# Altium schematic sheet 09. SDIO, PERIPHERAL.SchDoc
size A3
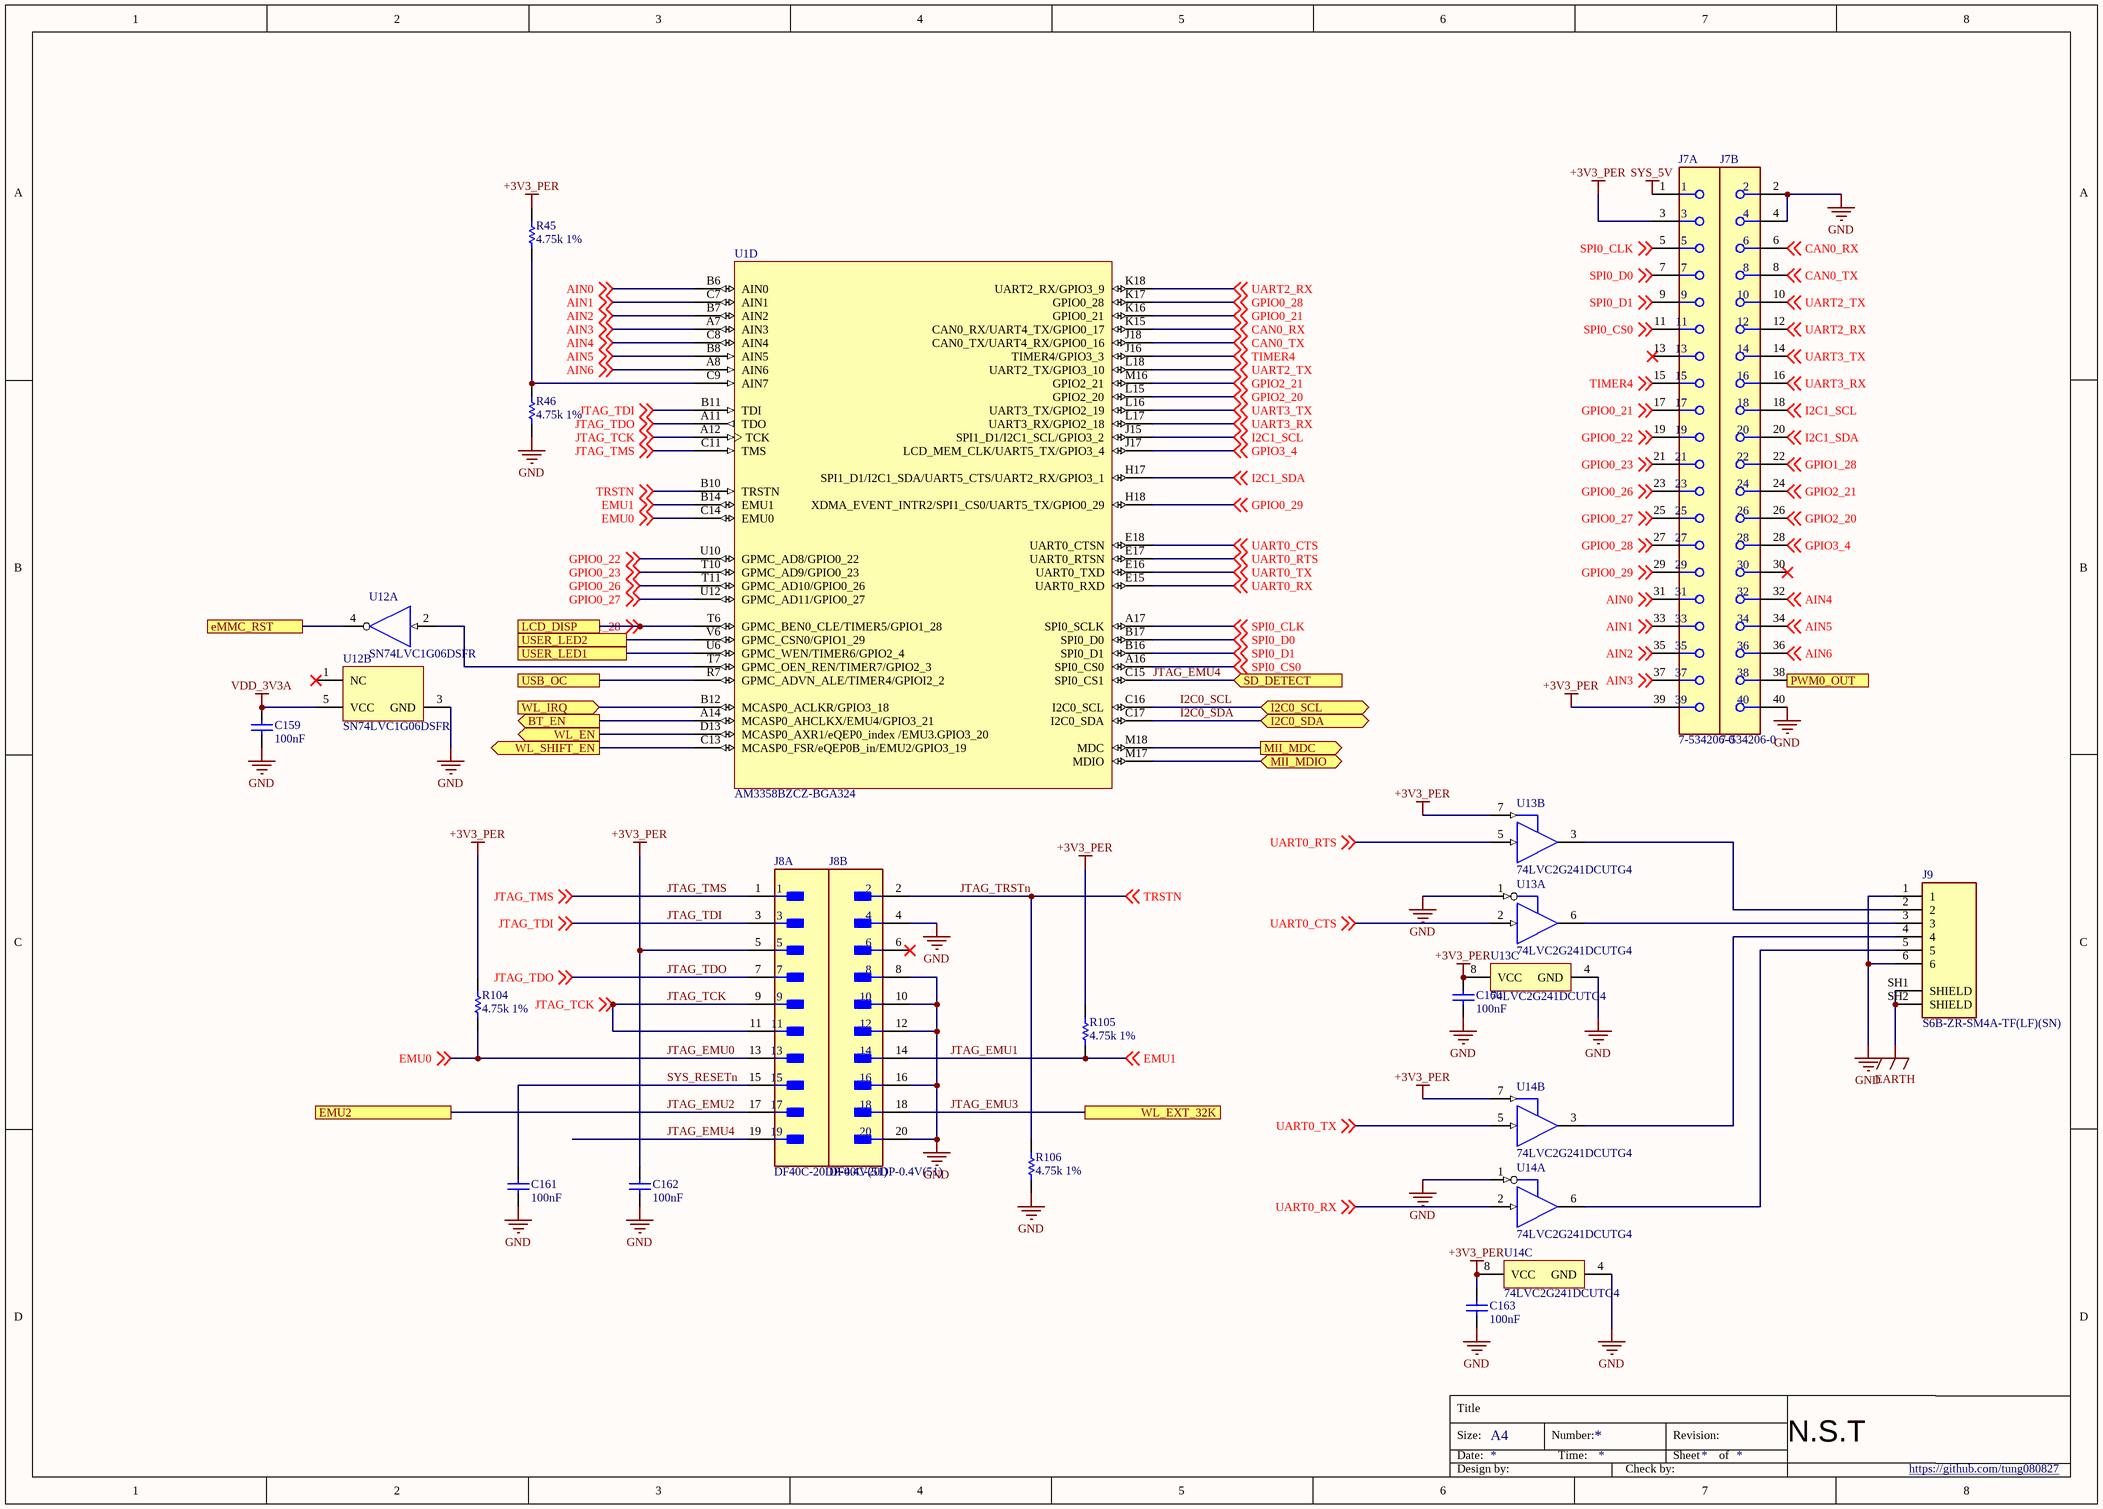
[diagram p0: 09. SDIO, PERIPHERAL.SchDoc]

## Parts
C159  100nF  [CAPC1005X55X25LL05T10]
C160  100nF  [CAPC1005X55X25LL05T10]
C161  100nF  [CAPC1005X55X25LL05T10]
C162  100nF  [CAPC1005X55X25LL05T10]
C163  100nF  [CAPC1005X55X25LL05T10]
J7  7-534206-0  [FP-7-534206-0-MFG]  (parts A,B of 2)
J8  DF40C-20DP-0.4V(51)  [FP-DF40C-20DP-0_4V_51-MFG]  (parts A,B of 3)
J9  S6B-ZR-SM4A-TF(LF)(SN)  [JST_S6B-ZR-SM4A-TF]
R45  4.75k 1%  [RESC1005X40X25LL05T05]
R46  4.75k 1%  [RESC1005X40X25LL05T05]
R104  4.75k 1%  [RESC1005X40X25LL05T05]
R105  4.75k 1%  [RESC1005X40X25LL05T05]
R106  4.75k 1%  [RESC1005X40X25LL05T05]
U1  AM3358BZCZ-BGA324  [TI-ZCZ324]  (part D of 11)
U12  SN74LVC1G06DSFR  [DSF0006A_V]  (parts A,B of 2)
U13  74LVC2G241DCUTG4  [DCU0008A_M]  (parts A,B,C of 3)
U14  74LVC2G241DCUTG4  [DCU0008A_M]  (parts A,B,C of 3)

## Ports
BT_EN (out), eMMC_RST, EMU2, I2C0_SCL (bidir), I2C0_SDA (bidir), LCD_DISP, MII_MDC (out), MII_MDIO (bidir), PWM0_OUT, SD_DETECT (in), USB_OC, USER_LED1, USER_LED2, WL_EN (out), WL_EXT_32K, WL_IRQ (in), WL_SHIFT_EN (out)

## Nets
+3V3_PER: C160.2 C162.2 C163.2 J7.3 J7.39 J8.5 R45.2 R104.2 R105.2 U13.7(2OE) U13.8(VCC) U14.7(2OE) U14.8(VCC)
EARTH: J9.SH1(SHIELD) J9.SH2(SHIELD)
GND: C159.1 C160.1 C161.1 C162.1 C163.1 J7.2 J7.4 J7.40 J8.4 J8.8 J8.10 J8.12 J8.16 J8.20 J9.1 J9.6 R46.1 R106.1 U12.3(GND) U13.1(1~{OE}) U13.4(GND) U14.1(1~{OE}) U14.4(GND)
SYS_5V: J7.1
VDD_3V3A: C159.2 U12.5(VCC)
AIN0: J7.31 U1.B6(AIN0) ; off-sheet AIN0
AIN1: J7.33 U1.C7(AIN1) ; off-sheet AIN1
AIN2: J7.35 U1.B7(AIN2) ; off-sheet AIN2
AIN3: J7.37 U1.A7(AIN3) ; off-sheet AIN3
AIN4: J7.32 U1.C8(AIN4) ; off-sheet AIN4
AIN5: J7.34 U1.B8(AIN5) ; off-sheet AIN5
AIN6: J7.36 U1.A8(AIN6) ; off-sheet AIN6
BT_EN: U1.A14(MCASP0_AHCLKX/EMU4/GPIO3_21) ; port BT_EN
CAN0_RX: J7.6 U1.K15(CAN0_RX/UART4_TX/GPIO0_17) ; off-sheet CAN0_RX
CAN0_TX: J7.8 U1.J18(CAN0_TX/UART4_RX/GPIO0_16) ; off-sheet CAN0_TX
eMMC_RST: U12.4(Y) ; port eMMC_RST
GPIO0_21: J7.17 U1.K16(GPIO0_21) ; off-sheet GPIO0_21
GPIO0_22: J7.19 U1.U10(GPMC_AD8/GPIO0_22) ; off-sheet GPIO0_22
GPIO0_23: J7.21 U1.T10(GPMC_AD9/GPIO0_23) ; off-sheet GPIO0_23
GPIO0_26: J7.23 U1.T11(GPMC_AD10/GPIO0_26) ; off-sheet GPIO0_26
GPIO0_27: J7.25 U1.U12(GPMC_AD11/GPIO0_27) ; off-sheet GPIO0_27
GPIO0_28: J7.27 U1.K17(GPIO0_28) ; off-sheet GPIO0_28
GPIO0_29: J7.29 U1.H18(XDMA_EVENT_INTR2/SPI1_CS0/UART5_TX/GPIO0_29) ; off-sheet GPIO0_29
GPIO1_28: J7.22 U1.T6(GPMC_BEN0_CLE/TIMER5/GPIO1_28) ; off-sheet GPIO1_28, port LCD_DISP
GPIO2_20: J7.26 U1.L15(GPIO2_20) ; off-sheet GPIO2_20
GPIO2_21: J7.24 U1.M16(GPIO2_21) ; off-sheet GPIO2_21
GPIO3_4: J7.28 U1.J17(LCD_MEM_CLK/UART5_TX/GPIO3_4) ; off-sheet GPIO3_4
I2C0_SCL: U1.C16(I2C0_SCL) ; port I2C0_SCL
I2C0_SDA: U1.C17(I2C0_SDA) ; port I2C0_SDA
I2C1_SCL: J7.18 U1.J15(SPI1_D1/I2C1_SCL/GPIO3_2) ; off-sheet I2C1_SCL
I2C1_SDA: J7.20 U1.H17(SPI1_D1/I2C1_SDA/UART5_CTS/UART2_RX/GPIO3_1) ; off-sheet I2C1_SDA
JTAG_EMU0: J8.13 R104.1 U1.C14(EMU0) ; off-sheet EMU0  [also labelled EMU0]
JTAG_EMU1: J8.14 R105.1 U1.B14(EMU1) ; off-sheet EMU1  [also labelled EMU1]
JTAG_EMU2: J8.17 ; port EMU2
JTAG_EMU3: J8.18 ; port WL_EXT_32K
JTAG_EMU4: J8.19 U1.C15(SPI0_CS1) ; port SD_DETECT
JTAG_TCK: J8.9 J8.11 U1.A12(TCK) ; off-sheet JTAG_TCK
JTAG_TDI: J8.3 U1.B11(TDI) ; off-sheet JTAG_TDI
JTAG_TDO: J8.7 U1.A11(TDO) ; off-sheet JTAG_TDO
JTAG_TMS: J8.1 U1.C11(TMS) ; off-sheet JTAG_TMS
JTAG_TRSTn: J8.2 R106.2 U1.B10(TRSTN) ; off-sheet TRSTN  [also labelled TRSTN]
MII_MDC: U1.M18(MDC) ; port MII_MDC
MII_MDIO: U1.M17(MDIO) ; port MII_MDIO
PWM0_OUT: J7.38 ; port PWM0_OUT
SPI0_CLK: J7.5 U1.A17(SPI0_SCLK) ; off-sheet SPI0_CLK
SPI0_CS0: J7.11 U1.A16(SPI0_CS0) ; off-sheet SPI0_CS0
SPI0_D0: J7.7 U1.B17(SPI0_D0) ; off-sheet SPI0_D0
SPI0_D1: J7.9 U1.B16(SPI0_D1) ; off-sheet SPI0_D1
SYS_RESETn: C161.2 J8.15
TIMER4: J7.15 U1.J16(TIMER4/GPIO3_3) ; off-sheet TIMER4
UART0_CTS: U1.E18(UART0_CTSN) U13.2(1A) ; off-sheet UART0_CTS
UART0_RTS: U1.E17(UART0_RTSN) U13.5(2A) ; off-sheet UART0_RTS
UART0_RX: U1.E15(UART0_RXD) U14.2(1A) ; off-sheet UART0_RX
UART0_TX: U1.E16(UART0_TXD) U14.5(2A) ; off-sheet UART0_TX
UART2_RX: J7.12 U1.K18(UART2_RX/GPIO3_9) ; off-sheet UART2_RX
UART2_TX: J7.10 U1.L18(UART2_TX/GPIO3_10) ; off-sheet UART2_TX
UART3_RX: J7.16 U1.L17(UART3_RX/GPIO2_18) ; off-sheet UART3_RX
UART3_TX: J7.14 U1.L16(UART3_TX/GPIO2_19) ; off-sheet UART3_TX
USB_OC: U1.R7(GPMC_ADVN_ALE/TIMER4/GPIOI2_2) ; port USB_OC
USER_LED1: U1.U6(GPMC_WEN/TIMER6/GPIO2_4) ; port USER_LED1
USER_LED2: U1.V6(GPMC_CSN0/GPIO1_29) ; port USER_LED2
WL_EN: U1.D13(MCASP0_AXR1/eQEP0_index_/EMU3.GPIO3_20) ; port WL_EN
WL_IRQ: U1.B12(MCASP0_ACLKR/GPIO3_18) ; port WL_IRQ
WL_SHIFT_EN: U1.C13(MCASP0_FSR/eQEP0B_in/EMU2/GPIO3_19) ; port WL_SHIFT_EN
NetJ9_2: J9.2 U13.3(2Y)
NetJ9_3: J9.3 U13.6(1Y)
NetJ9_4: J9.4 U14.3(2Y)
NetJ9_5: J9.5 U14.6(1Y)
NetR45_1: R45.1 R46.2 U1.C9(AIN7)
NetU1_T7: U1.T7(GPMC_OEN_REN/TIMER7/GPIO2_3) U12.2(A)

Not connected (* = marked no-connect by the designer): J7 13* 30*; J8 6*; U12 1(NC)*

## Notes on the sheet
- Title
- Size:
- Date:
- A4
- Number:
- Time:
- Revision:
- Sheet
- of
- N.S.T
- Design by:
- Check by:
- https://github.com/tung080827

## Library data of the parts
C159-C163 = CMP-2100-03641-1: Chip Capacitor, 0.1 uF, +/- 10%, 16 V, -55 to 125 degC, 0402 (1005 Metric), RoHS, Tape and Reel; Manufacturer: Murata; Material: Ceramic; Insulation Resistance: 10GR; Voltage: 16V; Dielectric: X7R; REACH SVHC: NoSVHC; Depth: 0.5mm; Case/Package: 0402; Datasheet URL: http://psearch.en.murata.com/capacitor/product/GRM155R71C104KA88%23.pdf; Lead Free: LeadFree; Dielectric Material: Ceramic; Manufacturer URL: http://www.murata.com/; Min Operating Temperature: -55degC; Length: 1mm; Case Code (Metric): 1005; Radiation Hardening: No; Package Reference: 0402; RoHSCompliant: true; Datasheet Version: 42675.0; Thickness: 0.022inch; Packaging: TapeandReel; Voltage Rating (DC): 16V; Tolerance: 10%; Max Operating Temperature: 125degC; Package Description: 2-Pin Surface Mount Device, Body 1 x 0.5 mm; Mount: SurfaceMount; Height: 0.5mm; Width: 0.5mm; Number of Pins: 2; Voltage Rating: 16V; Case Code (Imperial): 0402; Termination: SMD/SMT; Capacitance: 100nF; Package Quantity: 1
J7 = CMP-03369-000068-1: CONN RCPT 40POS 0.1 GOLD PCB; Manufacturer: TE Connectivity; Standoff Height: 0.38mm; Voltage Rating: 333V; Conn Orientation: Vertical; Is Female: yes; Pitch: 2.54mm; Number Of Contacts: 40; Current Rating: 2A; Conn Gender: Female; Temperature: -65°C to +105°C; Temperature Range High: +105°C; Temperature Range Low: -65°C; Package: 7-534206-0; Lead Free: Yes; Manufacturer Part Number: 7-534206-0; Contact Material: Gold,Nickel; Device Class L2: Headers and Wire Housings; RoHS: TRUE; Number Of Rows: 2; Octopart: https://octopart.com/7-534206-0-te+connectivity-39516831; Device Class L3: unset; Device Class L1: Connectors; Mouser Description: Headers & Wire Housings REC 2X20P VRT T/H; ComponentLink2URL: https://octopart.com/datasheet/7-534206-0-te+connectivity-39516831; ComponentLink2Description: Datasheet; Digikey Description: CONN RCPT 40POS 0.1 GOLD PCB; Footprint Url: https://www.mouser.in/datasheet/2/418/NG_CD_534206_R7-1252933.pdf; Category: Conn; Height: 8.9mm; Automotive: No
J8 = CMP-11605-000001-1: CONN PLUG 20POS SMD GOLD; Manufacturer: Hirose; Conn Orientation: Straight; Conn Gender: Male; Standoff Height: 0mm; Current Rating: 0.3A; Voltage Rating: 30V; Number Of Contacts: 20; Pitch: 0.4mm; Number Of Rows: 2; Automotive: No; Manufacturer Part Number: DF40C-20DP-0.4V(51); Category: Conn; Footprint Url: https://www.hirose.com/product/document?clcode=CL0684-4010-9-51&productname=DF40C-20DP-0.4V(51)&series=DF40&documenttype=2DDrawing&lang=en&documentid=0001001212; Temperature: -35°C to +85°C; Temperature Range Low: -35°C; RoHS: TRUE; Height: 1.29mm; Device Class L3: unset; Lead Free: Yes; ComponentLink2Description: Datasheet; ComponentLink2URL: https://www.hirose.com/product/document?clcode=CL0684-4010-9-51&productname=DF40C-20DP-0.4V(51)&series=DF40&documenttype=SpecSheet&lang=en&documentid=0000427721; Temperature Range High: +85°C; Octopart: https://octopart.com/df40c-20dp-0.4v%2851%29-hirose-11540400; Package: 0; Contact Material: Gold,Nickel; Digikey Description: CONN PLUG 20POS SMD GOLD; Device Class L1: Connectors; Device Class L2: Board to Board Connectors
J9 = S6B-ZR-SM4A-TF(LF)(SN): Connector Header Surface Mount, Right Angle 6 position 0.059 _1.50mm_; MP: S6B-ZR-SM4A-TF_LF__SN_; MF: JST Sales; Digi-Key_Purchase_URL: https://www.digikey.com/product-detail/en/jst-sales-america-inc/S6B-ZR-SM4A-TF_LF__SN_/455-1610-1-ND/858041?utm_source=snapeda&utm_medium=aggregator&utm_campaign=symbol; Package: None; Digi-Key_Part_Number: 455-1610-1-ND; Value: *; SnapEDA_Link: https://www.snapeda.com/parts/S6B-ZR-SM4A-TF%28LF%29%28SN%29/JST%20Sales%20America%20Inc./view-part/641277/?ref=snap
R45 R46 R104-R106 = CMP-2002-00054-1: Manufacturer: Vishay Dale; Part Number: CRCW04024K75FKED
U1 = AM3358BZCZ100: Sitara ARM Cortex-A8 32-Bit RISC Microprocessor, 1 GHz, SGX530 3D Graphics Engine, Programmable Real-Time Unit and Industrial Communication Subsystem (PRU-ICSS), 0 to 90 degC, 324-pin NFBGA (ZCZ), Green (RoHS & no Sb/Br); Supplier 1: Digi-Key
U12 = CMP-0859-00956-3: Single Inverter Buffer/Driver With Open-Drain Output, DSF0006A, LARGE T&R; Manufacturer: Texas Instruments; Voltage(Nom)(V): 1.8,2.5,3.3,5; Technology Family: LVC; Logic: Inverting; ICC @ Nom Voltage(Max)(mA): 0.01; VCC(Max)(V): 5.5; Output Drive (IOL/IOH)(Max)(mA): 32/-32; Bits(#): 1; 3-State Output: No; Input Type: CMOS/TTL; Sub-Family: Inverting Buffer/Driver; F @ Nom Voltage(Max)(Mhz): 150; Output Type: CMOS; tpd @ Nom Voltage(Max)(ns): 6.5,4,3; Rating: Catalog; VCC(Min)(V): 1.65; Generic Part Number: SN74LVC1G06; Schmitt Trigger: No; DatasheetVersion: SCES295W; Operating Temperature Range(C): -40 to 125,-40 to 85; PackageReference: DSF0006A
U13 U14 = CMP-0859-00582-3: Dual Buffer/Driver With 3-State Outputs, DCU0008A, SMALL T&R; Manufacturer: Texas Instruments; Generic Part Number: SN74LVC2G241; 3-State Output: Yes; tpd @ Nom Voltage(Max)(ns): 8.8,4.8,4.3,3.7; Voltage(Nom)(V): 1.8,2.5,3.3,5; Schmitt Trigger: No; Input Type: CMOS/TTL; F @ Nom Voltage(Max)(Mhz): 150; Bits(#): 2; ICC @ Nom Voltage(Max)(mA): 0.01; Logic: True; VCC(Min)(V): 1.65; Rating: Catalog; VCC(Max)(V): 5.5; Output Type: CMOS; Output Drive (IOL/IOH)(Max)(mA): 32/-32; Sub-Family: Non-Inverting Buffer/Driver; Technology Family: LVC; PackageReference: DCU0008A; DatasheetVersion: SCES210N; Operating Temperature Range(C): -40 to 125